# EasyEDA Pro project 3020摄像头 (0323).eprj

# Schematic 原理图
Board Name: esp32; Create Date: 2025-05-14; Page Name: 电源; Project Name: 3020摄像头 (0323); Schematic Name: 原理图; Update Date: 2026-03-18; Company: 嘉立创EDA; Page Size: A3; Version: V1.0
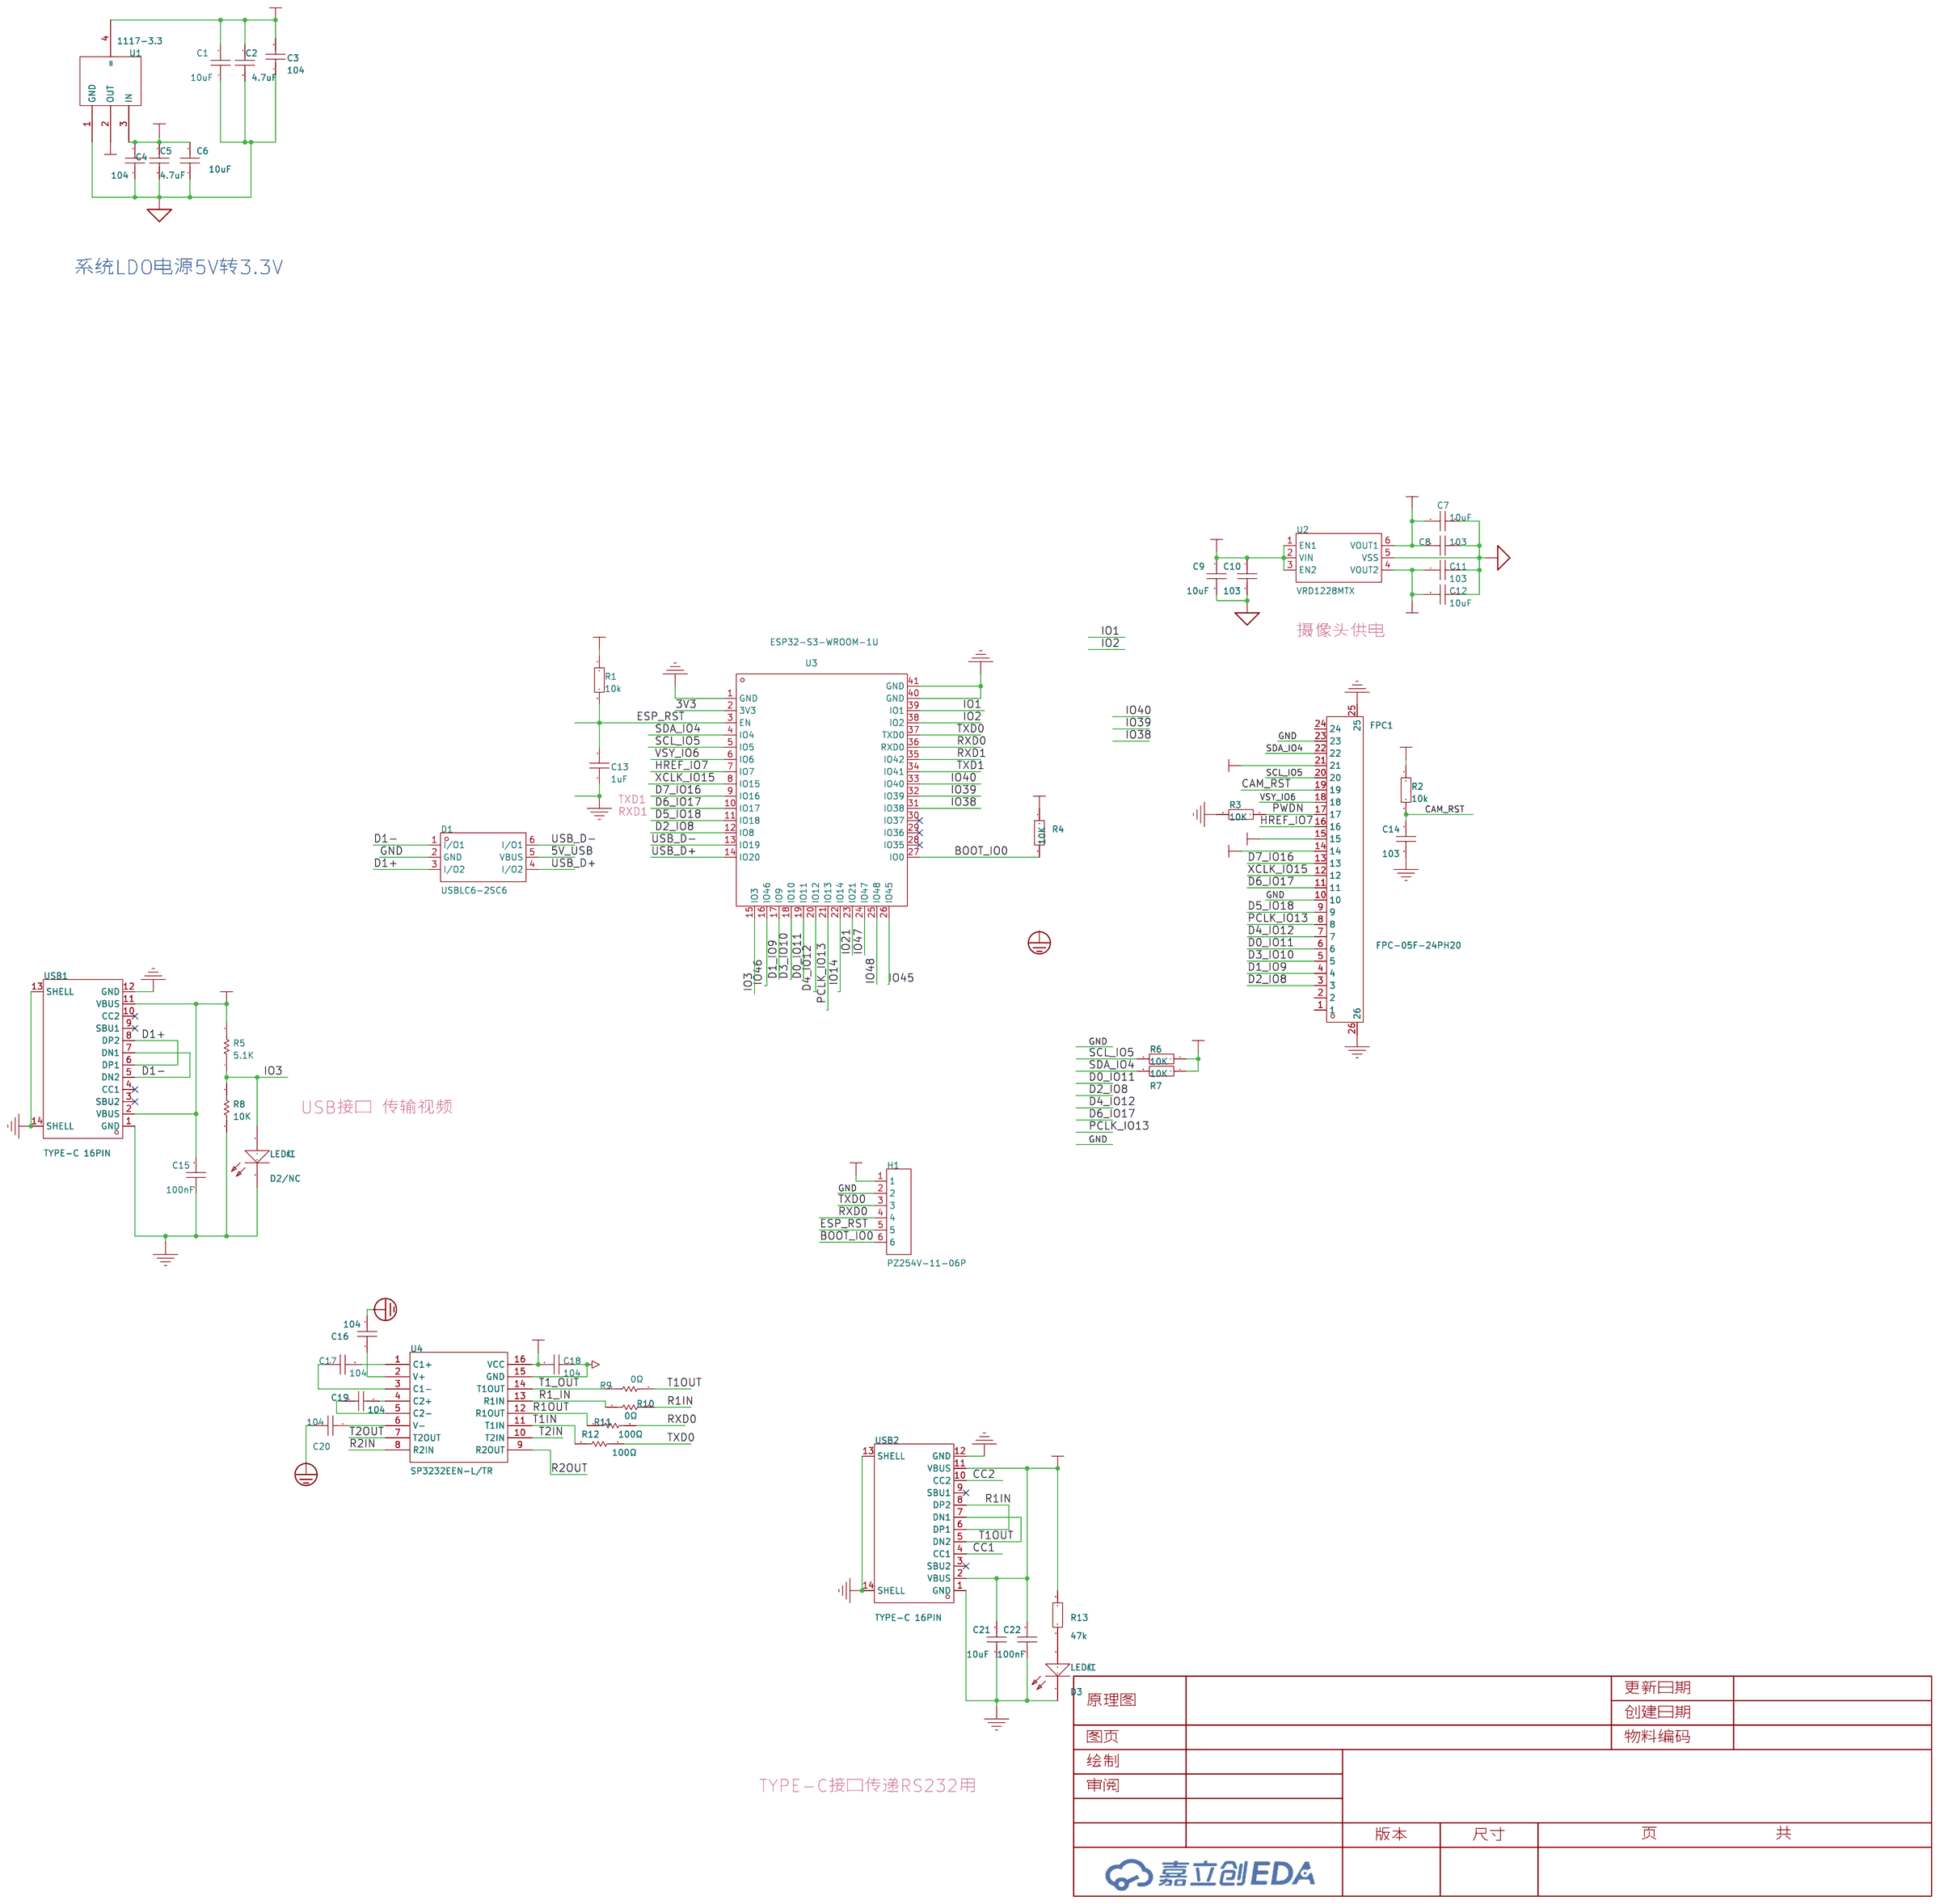
[diagram p0: schematic sheet]

## Parts
C1  10uF  [C1206]
C2  4.7uF  [0805C]
C3  104  [0603C]
C4  104  [0603C]
C5  4.7uF  [0805C]
C6  10uF  [C1206]
C7  10uF  [0805C]
C8  18pF  [0603C]
C9  10uF  [0805C]
C10  18pF  [0603C]
C11  18pF  [0603C]
C12  10uF  [0805C]
C13  1uF  [C0603]
C14  18pF  [0603C]
C15  100nF  [C0603]
C16  104  [0603C]
C17  104  [0603C]
C18  104  [0603C]
C19  104  [0603C]
C20  104  [0603C]
C21  10uF  [C1206]
C22  100nF  [C0603]
D1  USBLC6-2SC6  [SOT-23-6_L2.9-W1.6-P0.95-LS2.8-BL]
D2/NC  LED红  [0603L]
D3  LED红  [0603L]
FPC1  FPC-05F-24PH20  [FPC-SMD_24P-P0.50_FPC-05F-24PH20]
H1  PZ254V-11-06P  [HDR-TH_6P-P2.54-V-M]
R1  10k  [R0603]
R2  10k  [R0603]
R3  10K  [R0603]
R4  10K  [R0603]
R5  10K  [0603R]
R6  10K  [R0603]
R7  10K  [R0603]
R8  10K  [0603R]
R9  0Ω  [0603R]
R10  0Ω  [0603R]
R11  100Ω  [0603R]
R12  100Ω  [0603R]
R13  47k  [R0603]
U1  1117-3.3  [SOT-223]
U2  VRD1228MTX  [SOT-23-6_L2.9-W1.6-P0.95-LS2.8-BL]
U3  ESP32-S3-WROOM-1U  [ESP32-S3-WROOM-1U]
U4  SP3232EEN-L/TR  [SOIC-16_L9.9-W3.9-P1.27-LS6.0-BL]
USB1  TYPE-C 16PIN  [USB-C-SMD_TYPE-C-6PIN+]
USB2  TYPE-C 16PIN  [USB-C-SMD_TYPE-C-6PIN+]

## Library data of the parts
C1 C6 C21 = 104: Design Item ID: CAP; Library Name: SCH--װ--
C2 C5 C7 C9 C12 = 105: Design Item ID: CAP; Library Name: SCH--װ--
C3 C4 = 104: Capacitor (Semiconductor SIM Model); Published: 8-Jun-2000; LatestRevisionDate: 17-Jul-2002; LatestRevisionNote: Re-released for DXP Platform.; PackageReference: C1206; Publisher: Altium Limited; Origin Footprint 2: C1206; Origin Footprint 3: 0402; Origin Footprint 4: 1310[0504]; Origin Footprint 5: 1608[0603]; Origin Footprint 6: C1210; Origin Footprint 7: C0805; Origin Footprint 8: C1206; Origin Footprint 9: 0805; Origin Footprint 10: 0805L; Design Item ID: Cap Semi; Library Name: Miscellaneous Devices
C8 C10 C11 C14 = 33pF: Capacitor (Semiconductor SIM Model); Published: 8-Jun-2000; LatestRevisionDate: 17-Jul-2002; LatestRevisionNote: Re-released for DXP Platform.; PackageReference: C1206; Publisher: Altium Limited; Origin Footprint 2: C1206; Origin Footprint 3: 0402; Origin Footprint 4: 1310[0504]; Origin Footprint 5: 1608[0603]; Origin Footprint 6: C1210; Origin Footprint 7: C0805; Origin Footprint 8: C1206; Origin Footprint 9: 0805; Origin Footprint 10: 0805L; Design Item ID: Cap Semi; Library Name: Miscellaneous Devices
C13 = Cap: Capacitor; Published: 8-Jun-2000; LatestRevisionDate: 17-Jul-2002; LatestRevisionNote: Re-released for DXP Platform.; PackageReference: RAD-0.3; Publisher: Altium Limited; PackageDescription: Radial Cap, Thru-Hole; 2 Leads; 0.3 in Pin Spacing; Origin Footprint 2: C0402; Library Name: Miscellaneous Devices; Check: true
C15 C22 = Cap: Capacitor; Published: 8-Jun-2000; LatestRevisionDate: 17-Jul-2002; LatestRevisionNote: Re-released for DXP Platform.; PackageReference: RAD-0.3; Publisher: Altium Limited; PackageDescription: Radial Cap, Thru-Hole; 2 Leads; 0.3 in Pin Spacing; Origin Footprint 2: LC-0603_C; Origin Footprint 3: LC-0603_C; Library Name: Miscellaneous Devices
C16-C20 = 103: Capacitor (Semiconductor SIM Model); Published: 8-Jun-2000; LatestRevisionDate: 17-Jul-2002; LatestRevisionNote: Re-released for DXP Platform.; PackageReference: C1206; Publisher: Altium Limited; Origin Footprint 2: C1206; Origin Footprint 3: 0402; Origin Footprint 4: 1310[0504]; Origin Footprint 5: 1608[0603]; Origin Footprint 6: C1210; Origin Footprint 7: C0805; Origin Footprint 8: C1206; Origin Footprint 9: 0805; Origin Footprint 10: 0805L; Design Item ID: Cap Semi; Library Name: Miscellaneous Devices
D1 = USBLC6-2SC6: 最大钳位电压:15V;击穿电压:6V;; Supplier Part: C2687116; Manufacturer: UMW(友台半导体); Supplier Footprint: SOT-23-6; JLCPCB Part Class: 扩展库; Datasheet: https://atta.szlcsc.com/upload/public/pdf/source/20231109/512642D850D9873E7C519F71E85B9A10.pdf; Supplier: LCSC; Maximum Clamping Voltage: 15V; Breakdown Voltage: 6V; Number of Lines: 双路; Type: ESD
D2/NC D3 = LED3: Typical BLUE SiC LED; Published: 8-Jun-2000; LatestRevisionDate: 17-Dec-2003; LatestRevisionNote: PCB Footprint replaced.; DatasheetVersion: 16-Apr-2002; PackageVersion: 16-Apr-2002; PackageReference: 3.5X2.8X1.9; Publisher: Altium Limited; PackageDescription: SM LED; 2 C-Bend Leads; Body 3.5 x 2.8 x 1.9 mm, inc leads (LxWxH typ); Origin Footprint 2: 3.5X2.8X1.9; Library Name: Miscellaneous Devices; Check: true
FPC1 = FPC-05F-24PH20: LCSC Part Name: 翻盖式 卧贴 P数:24P 间距:0.5mm; Supplier Part: C2856805; Manufacturer: XUNPU(讯普); Supplier Footprint: SMD,P=0.5mm,卧贴; JLCPCB Part Class: 扩展库; Datasheet: https://item.szlcsc.com/datasheet/FPC-05F-24PH20/3056903.html; Supplier: LCSC; Locking Feature: 翻盖式; Contact Type: 卧贴; Number of Contacts: 24P; Pitch: 0.5mm; Mounting Type: 下接; FFC, FCB Thickness: 0.3mm; Height Above Board: 2mm; Contact Material: 磷青铜; Contact Plating: 锡; Operating Temperature: -25℃~+85℃; Rated Voltage (Max): 50V; Current Rating (Max): 500mA
H1 = PZ254V-11-06P: LCSC Part Name: 1x6P 间距:2.54mm 方针 直插; Supplier Part: C492405; Manufacturer: XFCN(兴飞); Supplier Footprint: 插件,P=2.54mm; JLCPCB Part Class: 扩展库; Datasheet: https://item.szlcsc.com/datasheet/PZ254V-11-06P/502961.html; Supplier: LCSC; Pin Structure: 1x6P; Pitch: 2.54mm; Circluar Pins/Square Pins: 方针; Mounting Type: 直插; Number of Rows: 单排; Number of Pins: 6P; Length of Mating Pin: 6mm; Insulation Height: 2.5mm; Length of End Connection Pin: 3mm; Contact Material: 黄铜; Operating Temperature: -40℃~+105℃; Color: 黑色
R1-R4 R6 R7 R13 = RT0603BRD0710KL: 电阻类型:薄膜电阻;阻值:10kΩ;精度:±0.1%;功率:100mW;温度系数:±25ppm/;最大工作电压:75V;工作温度范围:-55~+155;; LCSC Part Name: 10k-- --0.1%; Supplier Part: C95204; Manufacturer: YAGEO(----); Supplier Footprint: 0603; JLCPCB Part Class: Extended Part; Datasheet: https://atta.szlcsc.com/upload/public/pdf/source/20170217/1487301593756.pdf; Supplier: LCSC; Type: --Ĥ----; Tolerance: --0.1%; Power(Watts): 100mW; Temperature Coefficient: --25ppm/; Overload Voltage (Max): 75V; Operating Temperature Range: -55~+155; Origin Footprint 2: 0402R; Origin Footprint 3: 0402R; Origin Footprint 4: 0603; Check: true
R5 R8 = 10K: Resistor; Published: 8-Jun-2000; LatestRevisionDate: 17-Jul-2002; LatestRevisionNote: Re-released for DXP Platform.; PackageReference: AXIAL-0.3; Publisher: Altium Limited; Origin Footprint 2: AXIAL-0.3; Origin Footprint 3: R0805; Origin Footprint 4: 0805R; Design Item ID: RES; Library Name: SCH封装库
R9-R12 = 100: Resistor; Published: 8-Jun-2000; LatestRevisionDate: 17-Jul-2002; LatestRevisionNote: Re-released for DXP Platform.; PackageReference: AXIAL-0.3; Publisher: Altium Limited; Origin Footprint 2: AXIAL-0.3; Origin Footprint 3: R0805; Origin Footprint 4: 0805R; Design Item ID: RES; Library Name: SCH封装库
U1 = 1117-3.3: Design Item ID: LM1117; Library Name: Party600
U2 = VRD1228MTX: LCSC Part Name: 输入6V 输出1.2V 2.8V 300mA; Supplier Part: C697901; Manufacturer: AnaSem(安纳森); Supplier Footprint: SOT-23-6; JLCPCB Part Class: 扩展库; Datasheet: https://item.szlcsc.com/datasheet/VRD1228MTX/732378.html; Supplier: LCSC; Voltage - Supply: 6V; Output Voltage: 1.2V；2.8V; Power Supply Rejection Ratio (PSRR): 75dB@(1kHz); Voltage Dropout: 90mV; standby current: 25uA; Features: 过流保护；带使能；短路保护; Operating Temperature: -40℃~+85℃; Output Configuration: 正极; Number of Outputs: 2
U3 = ESP32-S3-WROOM-1U: LCSC Part Name: ESP32-S3-WROOM-1-N16R2; Supplier Part: C2913205; Manufacturer: ESPRESSIF(----); Manufacturer Part: ESP32-S3-WROOM-1(N16R2); Supplier Footprint: ģ--; JLCPCB Part Class: Extended Part; Datasheet: https://atta.szlcsc.com/upload/public/pdf/source/20220628/A2AC12B3C87735CAEB7EBE2DBE80936C.pdf; Supplier: LCSC; Design Item ID: ESP32-S3-WROOM-1(N16R2); Check: true
U4 = SP3232EEN-L/TR: LCSC Part Name: True3.0V至5.5V RS-232收发器; Supplier Part: C9378; Manufacturer: MaxLinear(迈凌); Supplier Footprint: SOIC-16; JLCPCB Part Class: 扩展库; Datasheet: https://item.szlcsc.com/datasheet/SP3232EEN-L%252FTR/9907.html; Supplier: LCSC; Type: 收发器; Number of Drivers: 2; Number of Receivers: 2; Data Rate: 235Kbps; Voltage - Supply: 3V~5.5V; Operating Temperature: -40℃~+85℃
USB1 USB2 = TYPE-C 16PIN 2MD(073): 连接器类型:Type-C;标准:-;公母:母;端口数量:1;触点数量:16P;安装方式:卧贴;额定电流 - 电源:5A;工作温度范围:-25℃~+85℃;; LCSC Part Name: Type-C 母 卧贴; Supplier Part: C2765186; Manufacturer: SHOU HAN(首韩); Supplier Footprint: SMD; JLCPCB Part Class: Extended Part; Datasheet: https://atta.szlcsc.com/upload/public/pdf/source/20211123/39B17C16241EAC15C5E277BDA434118E.pdf; Supplier: LCSC; Connector Type: Type-C; Gender: 母; Number of Ports: 1; Number of Contacts: 16P; Mounting Style: 卧贴; Current Rating - Power (Max): 5A; Operating Temperature Range: -25℃~+85℃

## Nets
1.2V: C7.1 C8.1 FPC1.15 U2.6(VOUT1)
2.8V: C11.1 C12.1 FPC1.14 FPC1.21 U2.4(VOUT2)
3V3: C1.2 C2.1 C3.2 R1.1 R2.1 R4.1 R6.1 R7.1 U1.2(OUT) U1.4(=) U3.2(3V3)
5V_USB: C15.2 D1.5(VBUS) R5.2 USB1.2(VBUS) USB1.11(VBUS)
5V_VCC: C4.2 C5.1 C6.2 C9.1 C10.1 C18.2 C21.2 C22.2 H1.1 R13.2 U1.3(IN) U2.1(EN1) U2.2(VIN) U2.3(EN2) U4.16(VCC) USB2.2(VBUS) USB2.11(VBUS)
GND: C1.1 C2.2 C3.1 C4.1 C5.2 C6.1 C7.2 C8.2 C9.2 C10.2 C11.2 C12.2 C13.1 C14.2 C15.1 C16.1 C18.1 C20.2 C21.1 C22.1 D1.2(GND) D2/NC.2(K) D3.2(K) FPC1.10 FPC1.23 FPC1.25 FPC1.26 H1.2 R3.2 R8.1 U1.1(GND) U2.5(VSS) U3.1(GND) U3.40(GND) U3.41(GND) U4.15(GND) USB1.1(GND) USB1.12(GND) USB1.13(SHELL) USB1.14(SHELL) USB2.1(GND) USB2.12(GND) USB2.13(SHELL) USB2.14(SHELL)
BOOT_IO0: H1.6 R4.2 U3.27(IO0)
CAM_RST: C14.1 FPC1.19 R2.2
CC1: USB2.4(CC1)
CC2: USB2.10(CC2)
D0_IO11: FPC1.6 U3.19(IO11)
D1+: D1.3(I/O2) USB1.6(DP1) USB1.8(DP2)
D1-: D1.1(I/O1) USB1.5(DN2) USB1.7(DN1)
D1_IO9: FPC1.4 U3.17(IO9)
D2_IO8: FPC1.3 U3.12(IO8)
D3_IO10: FPC1.5 U3.18(IO10)
D4_IO12: FPC1.7 U3.20(IO12)
D5_IO18: FPC1.9 U3.11(IO18)
D6_IO17: FPC1.11 U3.10(IO17)
D7_IO16: FPC1.13 U3.9(IO16)
ESP_RST: C13.2 H1.5 R1.2 U3.3(EN)
HREF_IO7: FPC1.16 U3.7(IO7)
IO1: U3.39(IO1)
IO2: U3.38(IO2)
IO3: D2/NC.1(A) R5.1 R8.2 U3.15(IO3)
IO14: U3.22(IO14)
IO21: U3.23(IO21)
IO38: U3.31(IO38)
IO39: U3.32(IO39)
IO40: U3.33(IO40)
IO45: U3.26(IO45)
IO46: U3.16(IO46)
IO47: U3.24(IO47)
IO48: U3.25(IO48)
PCLK_IO13: FPC1.8 U3.21(IO13)
PWDN: FPC1.17 R3.1
R1_IN: R10.1 U4.13(R1IN)
R1IN: R10.2 USB2.6(DP1) USB2.8(DP2)
R1OUT: R11.1 U4.12(R1OUT)
R2IN: U4.8(R2IN)
R2OUT: U4.9(R2OUT)
RXD0: H1.4 R11.2 U3.36(RXD0)
RXD1: U3.35(IO42)
SCL_IO5: FPC1.20 R6.2 U3.5(IO5)
SDA_IO4: FPC1.22 R7.2 U3.4(IO4)
T1_OUT: R9.1 U4.14(T1OUT)
T1IN: R12.1 U4.11(T1IN)
T1OUT: R9.2 USB2.5(DN2) USB2.7(DN1)
T2IN: U4.10(T2IN)
T2OUT: U4.7(T2OUT)
TXD0: H1.3 R12.2 U3.37(TXD0)
TXD1: U3.34(IO41)
USB_D+: D1.4(I/O2) U3.14(IO20)
USB_D-: D1.6(I/O1) U3.13(IO19)
VSY_IO6: FPC1.18 U3.6(IO6)
XCLK_IO15: FPC1.12 U3.8(IO15)
$9N284520: C20.1 U4.6(V-)
$9N284523: C16.2 U4.2(V+)
$9N284524: C19.2 U4.4(C2+)
$9N284525: C19.1 U4.5(C2-)
$9N284526: C17.2 U4.1(C1+)
$9N284527: C17.1 U4.3(C1-)
$9N284875: D3.1(A) R13.1

Not connected (* = marked no-connect by the designer): FPC1 1 2 24; U3 28(IO35)* 29(IO36)* 30(IO37)*; USB1 3(SBU2)* 4(CC1)* 9(SBU1)* 10(CC2)*; USB2 3(SBU2)* 9(SBU1)*

## Notes on the sheet
- 系统LDO电源5V转3.3V
- 摄像头供电
- RXD1
- TXD1
- USB接口 传输视频
- TYPE-C接口传递RS232用

# Board PCB
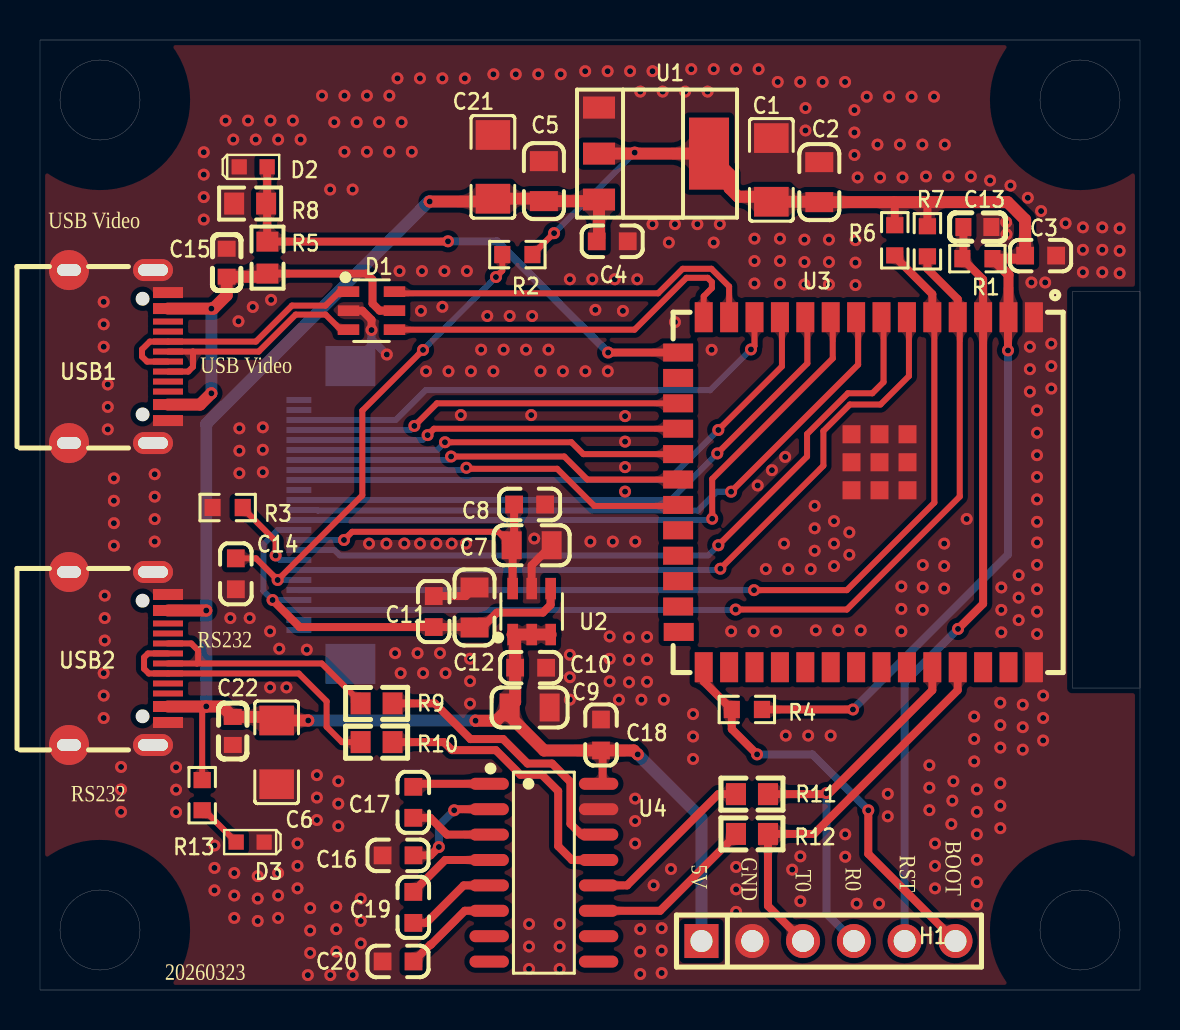
[diagram p1: board, top side]
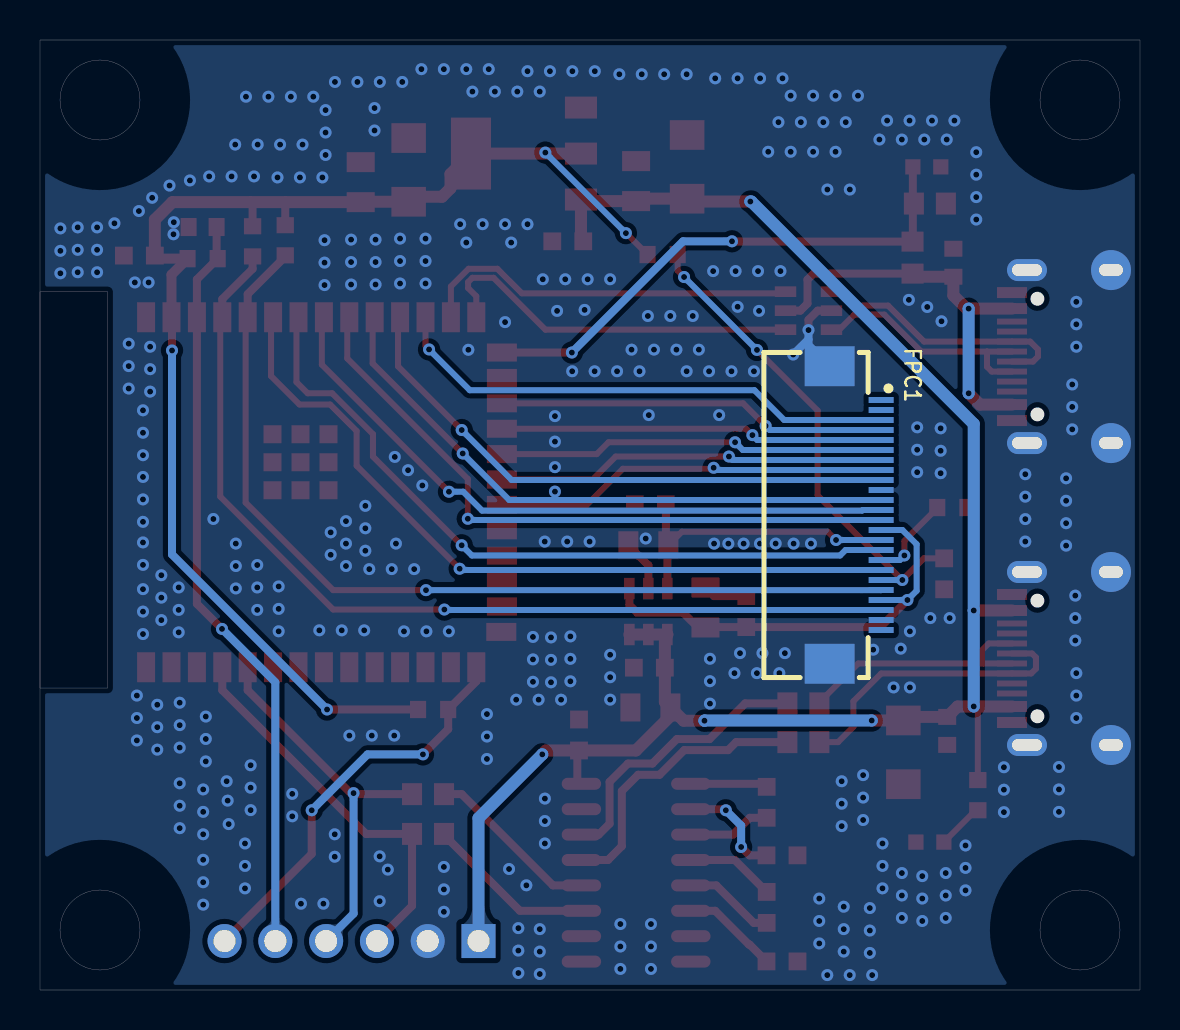
[diagram p2: board, bottom side, seen from below]

Outline 55 x 47.5 mm; copper layers: Top Layer, Bottom Layer. Coordinates in mm from the lower left corner of the outline.
Outline path: rectangle 0,47.5 55,0 ; circle c3,44.5 r2 ; circle c3,3 r2 ; rectangle 51.61,34.91 55,15.1 ; circle c52,44.5 r2 ; circle c52,3 r2
Stack: Top Layer 0.035mm / Dielectric1 1.51mm FR4 er 4.5 / Bottom Layer 0.035mm

## Design rules (mm)
net D1+: DP2
net USB_D+: DP1
net USB_D-: DP1
template: 用户自定义配置
spacing Default (default): track to track 0.152, other pairs 0 to 0.152
track width Default (default): min 0.254, default 0.254, max 25.4
differential pair differentialPair (default): width min 0.127, default 0.254, max 2.54; gap min 0.152, default 0.152
via Default (default): diameter min 0.25, default 0.61, max 100.025; hole min 0.2, default 0.305, max 59.995

## Placement (name value [footprint] x y rotation side)
C1  10uF  [C1206]  36.57 41 270 top
C2  4.7uF  [0805C]  38.96 40.39 90 top
C3  104  [0603C]  50.03 36.72 180 top
C4  104  [0603C]  28.61 37.43 180 top
C5  4.7uF  [0805C]  25.19 40.44 90 top
C6  10uF  [C1206]  11.83 11.88 90 top
C7  10uF  [0805C]  24.58 22.24 0 top
C8  18pF  [0603C]  24.48 24.28 0 top
C9  10uF  [0805C]  24.48 14.13 0 top
C10  18pF  [0603C]  24.53 16.12 0 top
C11  18pF  [0603C]  19.69 18.92 90 top
C12  10uF  [0805C]  21.73 19.13 90 top
C13  1uF  [C0603]  46.87 38.15 180 top
C14  18pF  [0603C]  9.79 20.81 270 top
C15  100nF  [C0603]  9.33 36.36 270 top
C16  104  [0603C]  17.9 6.73 0 top
C17  104  [0603C]  18.67 9.38 90 top
C18  104  [0603C]  28.05 12.75 270 top
C19  104  [0603C]  18.67 4.13 90 top
C20  104  [0603C]  17.9 1.43 180 top
C21  10uF  [C1206]  22.64 41.16 270 top
C22  100nF  [C0603]  9.64 12.95 90 top
D1  USBLC6-2SC6  [SOT-23-6_L2.9-W1.6-P0.95-LS2.8-BL]  16.58 33.97 270 top
D2  LED红  [0603L]  10.66 41.16 180 top
D3  LED红  [0603L]  10.51 7.4 0 top
FPC1  FPC-05F-24PH20  [FPC-SMD_24P-P0.50_FPC-05F-24PH20]  14.23 23.75 270 bottom
H1  PZ254V-11-06P  [HDR-TH_6P-P2.54-V-M]  39.42 2.45 0 top
R1  10k  [R0603]  46.87 36.57 180 top
R2  10k  [R0603]  23.87 36.77 180 top
R3  10K  [R0603]  9.38 24.12 180 top
R4  10K  [R0603]  35.34 14.03 180 top
R5  10K  [0603R]  11.37 36.62 270 top
R6  10K  [R0603]  42.74 37.49 270 top
R7  10K  [R0603]  44.37 37.43 270 top
R8  10K  [0603R]  10.51 39.32 0 top
R9  0Ω  [0603R]  16.83 14.33 180 top
R10  0Ω  [0603R]  16.83 12.39 180 top
R11  100Ω  [0603R]  35.6 9.79 0 top
R12  100Ω  [0603R]  35.6 7.8 0 top
R13  47k  [R0603]  8.11 9.74 90 top
U1  1117-3.3  [SOT-223]  30.65 41.82 270 top
U2  VRD1228MTX  [SOT-23-6_L2.9-W1.6-P0.95-LS2.8-BL]  24.58 18.92 0 top
U3  -  [ESP32-S3-WROOM-1U]  40.8 24.89 270 top
U4  SP3232EEN-L/TR  [SOIC-16_L9.9-W3.9-P1.27-LS6.0-BL]  25.19 5.87 270 top
USB1  TYPE-C 16PIN  [USB-C-SMD_TYPE-C-6PIN+]  3.83 31.67 270 top
USB2  TYPE-C 16PIN  [USB-C-SMD_TYPE-C-6PIN+]  3.83 16.58 270 top

## Footprints (pads in the part's own frame, mm; a bottom-side part is the same pattern mirrored in y, then rotated)
0603C
  rect 0.889x0.889 smd: 1(-0.774,0) 2(0.774,0)
0603L
  rect 0.762x0.762 smd: 1(-0.699,0) 2(0.699,0)
0603R
  rect 1x1.1 smd: 1(-0.8,0) 2(0.8,0)
0805C
  rect 1x1.4 smd: 1(-1,0) 2(1,0)
C0603
  rect 0.8x0.9 smd: 1(-0.7,0) 2(0.7,0)
C1206
  rect 1.485x1.728 smd: 1(-1.593,0) 2(1.593,0)
ESP32-S3-WROOM-1U
  rect 1.5x0.9 smd: 1(-8.75,8.895) 2(-8.75,7.625) 3(-8.75,6.355) 4(-8.75,5.085) 5(-8.75,3.815) 6(-8.75,2.545) 7(-8.75,1.275) 8(-8.75,0.005) 9(-8.75,-1.265) 10(-8.75,-2.535) 11(-8.75,-3.805) 12(-8.75,-5.075) 13(-8.75,-6.345) 14(-8.75,-7.615) 27(8.75,-7.615) 28(8.75,-6.345) 29(8.75,-5.075) 30(8.75,-3.805) 31(8.75,-2.535) 32(8.75,-1.265) 33(8.75,0.005) 34(8.75,1.275) 35(8.75,2.545) 36(8.75,3.815) 37(8.75,5.085) 38(8.75,6.355) 39(8.75,7.625) 40(8.75,8.895)
  rect 0.9x1.5 smd: 15(-6.985,-8.895) 16(-5.715,-8.895) 17(-4.445,-8.895) 18(-3.175,-8.895) 19(-1.905,-8.895) 20(-0.635,-8.895) 21(0.635,-8.895) 22(1.905,-8.895) 23(3.175,-8.895) 24(4.445,-8.895) 25(5.715,-8.895) 26(6.985,-8.865)
  rect 0.9x0.9 smd: 41(-2.9,2.575) 41(-2.9,1.175) 41(-2.9,-0.225) 41(-1.5,2.575) 41(-1.5,1.175) 41(-1.5,-0.225) 41(-0.1,2.575) 41(-0.1,1.175) 41(-0.1,-0.225)
FPC-SMD_24P-P0.50_FPC-05F-24PH20
  rect 0.3x1.25 smd: 1(-5.75,1.288) 2(-5.25,1.288) 3(-4.75,1.288) 4(-4.25,1.288) 5(-3.75,1.288) 6(-3.25,1.288) 7(-2.75,1.288) 8(-2.25,1.288) 9(-1.75,1.288) 10(-1.25,1.288) 11(-0.75,1.288) 12(-0.25,1.288) 13(0.25,1.288) 14(0.75,1.288) 15(1.25,1.288) 16(1.75,1.288) 17(2.25,1.288) 18(2.75,1.288) 19(3.25,1.288) 20(3.75,1.288) 21(4.25,1.288) 22(4.75,1.288) 23(5.25,1.288) 24(5.75,1.288)
  rect 2x2.5 smd: 25(7.44,-1.288) 26(-7.44,-1.288)
HDR-TH_6P-P2.54-V-M
  rect 1.7x1.7 hole 1.1: 1(-6.35,0)
  round 1.7 hole 1.1: 2(-3.81,0) 3(-1.27,0) 4(1.27,0) 5(3.81,0) 6(6.35,0)
R0603
  rect 0.806x0.864 smd: 1(-0.753,0) 2(0.753,0)
SOIC-16_L9.9-W3.9-P1.27-LS6.0-BL
  oval 0.602x1.971 smd: 1(-4.445,-2.736) 2(-3.175,-2.736) 3(-1.905,-2.736) 4(-0.635,-2.736) 5(0.635,-2.736) 6(1.905,-2.736) 7(3.175,-2.736) 8(4.445,-2.736) 9(4.445,2.736) 10(3.175,2.736) 11(1.905,2.736) 12(0.635,2.736) 13(-0.635,2.736) 14(-1.905,2.736) 15(-3.175,2.736) 16(-4.445,2.736)
SOT-23-6_L2.9-W1.6-P0.95-LS2.8-BL
  rect 0.532x1.072 smd: 1(-0.95,-1.149) 2(0,-1.149) 3(0.95,-1.149) 4(0.95,1.149) 5(0,1.149) 6(-0.95,1.149)
SOT-223
  rect 1.1x1.6 smd: 1(-2.3,-2.7) 2(0,-2.7) 3(2.3,-2.7)
  rect 3.6x2 smd: 4(0,2.8)
USB-C-SMD_TYPE-C-6PIN+
  rect 0.55x1.5 smd: 1(-3.2,2.575) 2(-2.4,2.575) 11(2.4,2.575) 12(3.2,2.575)
  rect 0.3x1.5 smd: 3(-1.75,2.575) 4(-1.25,2.575) 5(-0.75,2.575) 6(-0.25,2.575) 7(0.25,2.575) 8(0.75,2.575) 9(1.25,2.575) 10(1.75,2.575)
  oval 1.1x2 hole 0.6x1.5: 13(-4.325,1.825) 14(4.325,1.825)
  oval 2x2 hole 0.6x1.2: 13(-4.325,-2.375) 14(4.325,-2.375)

## Nets
As in the schematic, except:
GND: C1.1 C2.2 C3.1 C4.1 C5.2 C6.1 C7.2 C8.2 C9.2 C10.2 C11.2 C12.2 C13.1 C14.2 C15.1 C16.1 C18.1 C20.2 C21.1 C22.1 D1.2 D2.2 D3.2 FPC1.10 FPC1.23 FPC1.25 FPC1.26 H1.2 R3.2 R8.1 U1.1 U2.5 U3.1 U3.40 U3.41 U4.15 USB1.1 USB1.12 USB1.13 USB1.14 USB2.1 USB2.12 USB2.13 USB2.14
IO3: D2.1 R5.1 R8.2 U3.15

Pads without a net: FPC1 1 2 24; U3 28 29 30; USB1 3 4 9 10; USB2 3 9

## Via types
v1: diameter 0.6, hole 0.3, Top Layer to Bottom Layer, 414 vias

## Routing (per net, layer and track width the routed paths; a pad name or vN(x,y) marks a point on that pad's centre or on a via; arc(x,y) is an arc through that point)
1.2V: length 15.4
  Top Layer w0.3: v1(15.2,22.5) 15.61,22.91 22.91,22.91 C7.1
  Top Layer w0.4: C8.1 23.71,22.36 C7.1 23.63,22.19 U2.6
  Bottom Layer w0.3: 12.94,22.5 v1(15.2,22.5)
2.8V: length 22.1
  Top Layer w0.4: U2.4 25.53,19.26 25.14,18.87 22.85,18.87 22.1,18.13 C12.1 21.7,18.15 C11.1 12.98,18.15 v1(11.63,19.5)
  Bottom Layer w0.3: 12.94,19.5 v1(11.63,19.5) 11.17,19.96 11.17,22.29 11.88,23 12.94,23
3V3: length 66.9
  Top Layer w0.3: R2.1 25.69,37.84 v1(25.7,37.84)
  Top Layer w0.4: R4.1 v1(40.65,14.03) ; R6.1 42.74,39.38 42.72,39.39 ; v1(48.4,31.98) 48.4,33.61 U3.2 ; R7.1 44.37,39.3 44.47,39.39
  Top Layer w0.5: U3.2 48.43,35.77 R1.1 49.1,36.57 C3.2
  Top Layer w0.6: U1.2 U1.4 34.48,40.8 34.48,40.09 34.9,39.66 36.32,39.66 C1.2 38.95,39.41 C2.1 48.38,39.39 49.26,38.52 C3.2
  Bottom Layer w0.3: v1(25.7,37.84) v1(29.73,41.87)
  Bottom Layer w0.4: v1(40.65,14.03) 48.4,21.78 v1(48.4,31.98)
5V_USB: length 20.7
  Top Layer w0.4: R5.2 16.33,35.82 16.63,35.52 16.63,34.32 16.98,33.97 D1.5
  Top Layer w0.6: USB1.2 8.67,34.07 9.33,34.73 C15.2 11.22,35.66 R5.2 ; v1(8.57,29.84) 8,29.27 USB1.11
  Bottom Layer w0.6: v1(8.57,29.84) v1(8.57,34.07)
5V_VCC: length 89.7
  Top Layer w0.3: R13.2 8.11,13.97 8.31,14.17 v1(8.31,14.18)
  Top Layer w0.4: 28.05,11.98 28.13,11.89 28.13,10.31
  Top Layer w0.6: USB2.11 9.12,14.17 C22.2 11.65,13.65 C6.2 v1(13.41,13.48) ; U2.3 U2.2 U2.1 23.76,17.65 C10.1 23.76,14.4 C9.1 ; v1(21.78,13.46) 22.82,13.46 C9.1 ; v1(29.89,11.78) 29.69,11.98 25.2,11.98 23.48,13.7 C9.1 ; USB2.2 v1(8.31,18.98) ; v1(19.48,39.42) 22.5,39.42 C21.2 25.07,39.56 C5.1 27.87,39.44 U1.3 27.95,37.55 C4.2
  Bottom Layer w0.6: v1(21.78,13.46) 21.77,13.48 v1(13.41,13.48) ; v1(8.31,14.18) v1(8.31,18.98) 8.31,28.31 19.43,39.42 v1(19.48,39.42) ; v1(29.89,11.78) 33.07,8.59 H1.1
GND: length 10
  Top Layer w0.4: 15.43,33.97 16.12,33.97 16.58,33.51 v1(16.58,33) ; C11.2 21.3,19.7 C12.2 ; U2.5 24.58,21.24 C7.2
  Bottom Layer w0.4: v1(16.58,33) 16.58,32.54 ; 16.58,32.54 16.58,32.25 FPC1.26 ; 16.58,32.54 v1(17.34,31.77)
  vias: v1(3.19,34.41) v1(3.19,33.29) v1(3.19,32.16) v1(3.24,19.72) v1(3.24,18.6) v1(3.24,17.48) v1(3.19,15.84) v1(3.19,14.72) v1(3.19,13.6) v1(3.39,30.28) v1(3.39,29.15) v1(3.39,28.03) v1(3.7,25.58) v1(3.7,24.46) v1(3.7,23.34) v1(3.7,22.22) v1(4.05,11.15) v1(4.05,10.03) v1(4.05,8.91) v1(5.73,25.79) v1(5.73,24.67) v1(5.73,23.54) v1(5.73,22.42) v1(6.8,11.14) v1(6.8,10.02) v1(6.8,8.89) v1(8.19,41.89) v1(8.19,40.77) v1(8.19,39.65) v1(8.19,38.52) v1(8.72,7.23) v1(8.72,6.1) v1(8.72,4.98) v1(9.28,43.47) v1(9.52,18.6) v1(9.66,42.52) v1(9.71,5.85) v1(9.71,4.73) v1(9.71,3.6) v1(9.92,33.44) v1(9.97,28.08) v1(9.97,26.96) v1(9.97,25.84) v1(10.4,43.47) v1(10.48,18.6) v1(10.64,34.15) v1(10.79,42.52) v1(10.89,5.69) v1(10.89,4.57) v1(10.89,3.45) v1(11.14,28.13) v1(11.14,27.01) v1(11.14,25.89) v1(11.52,43.47) v1(11.56,34.51) v1(11.51,17.93) v1(11.51,15.13) v1(11.91,42.52) v1(11.91,5.85) v1(11.91,4.73) v1(11.91,3.6) v1(11.96,17.07) v1(12.32,15.13) v1(12.64,43.47) v1(12.88,7.33) v1(12.88,6.2) v1(12.88,5.08) v1(13.03,42.52) v1(13.34,17.02) v1(13.39,0.75) v1(13.51,4.1) v1(13.51,2.97) v1(13.51,1.85) v1(13.84,10.74) v1(13.84,9.62) v1(13.84,8.5) v1(14.1,44.72) v1(14.51,40.02) v1(14.51,0.75) v1(14.71,43.39) v1(14.81,4.16) v1(14.81,3.04) v1(14.81,1.92) v1(14.92,10.44) v1(14.92,9.32) v1(14.92,8.19) v1(15.22,44.72) v1(15.22,41.91) v1(15.63,40.02) v1(15.64,0.75) v1(15.83,43.39) v1(16.04,4.57) v1(16.04,3.45) v1(16.04,2.33) v1(16.35,44.72) v1(16.35,41.91) v1(16.45,22.32) v1(16.96,43.39) v1(17.32,22.32) v1(17.47,44.72) v1(17.47,41.91) v1(17.76,16.84) v1(17.88,45.58) v1(17.98,35.94) v1(18.03,15.84) v1(18.08,43.39) v1(18.22,22.32) v1(18.59,41.91) v1(18.88,16.84) v1(19,45.58) v1(19.05,33.96) v1(19,22.32) v1(19.1,35.94) v1(19.16,15.84) v1(19.3,30.94) v1(19.82,22.32) v1(20,16.84) v1(20.12,45.58) v1(20.12,34.16) v1(20.22,35.94) v1(20.28,15.84) v1(20.42,30.94) v1(20.58,22.32) v1(21.04,28.74) v1(21.24,45.58) v1(21.34,35.94) v1(21.3,22.32) v1(21.55,30.94) v1(21.5,16.56) v1(21.5,15.44) v1(21.5,14.32) v1(22.06,32.02) v1(22.36,33.7) v1(22.67,45.79) v1(22.67,30.94) v1(23.18,32.02) v1(23.48,33.7) v1(23.79,45.79) v1(24.3,32.02) v1(24.45,3.3) v1(24.45,2.18) v1(24.45,1.05) v1(24.61,33.7) v1(24.56,28.74) v1(24.71,22.57) v1(24.91,45.79) v1(25.03,30.94) v1(25.42,32.02) v1(26.04,45.79) v1(25.98,3.3) v1(25.98,2.18) v1(25.98,1.05) v1(26.15,30.94) v1(26.49,35.54) v1(26.49,16.76) v1(26.49,15.64) v1(26.49,14.52) v1(27.26,45.94) v1(27.27,30.94) v1(27.52,22.42) v1(27.62,35.54) v1(27.77,34.01) v1(28.38,45.94) v1(28.39,30.94) v1(28.48,17.68) v1(28.48,16.56) v1(28.48,15.44) v1(28.64,22.42) v1(28.74,35.54) v1(28.95,14.52) v1(29.15,33.96) v1(29.25,28.69) v1(29.25,27.42) v1(29.25,26.14) v1(29.45,17.63) v1(29.45,16.51) v1(29.45,15.38) v1(29.5,45.94) v1(29.76,9.57) v1(29.76,8.45) v1(29.76,7.33) v1(29.76,22.42) v1(29.86,35.54) v1(30.01,44.92) v1(30.01,3.04) v1(30.01,1.92) v1(30.01,0.8) v1(30.07,14.52) v1(30.35,17.65) v1(30.35,16.53) v1(30.35,15.41) v1(30.63,45.94) v1(30.63,38.29) v1(30.68,5.23) v1(31.14,44.92) v1(31.08,3.09) v1(31.08,1.97) v1(31.08,0.85) v1(31.19,14.52) v1(31.44,37.37) v1(31.55,6.05) v1(31.75,38.29) v1(31.75,33.39) v1(32.26,44.92) v1(32.56,46.04) v1(32.65,13.8) v1(32.65,12.67) v1(32.65,11.55) v1(32.87,38.29) v1(33.38,44.92) v1(33.58,32.01) v1(33.69,46.04) v1(33.69,37.37) v1(33.99,38.29) v1(34.56,17.93) v1(34.81,46.04) v1(34.81,6.15) v1(34.81,5.03) v1(34.81,3.91) v1(35.72,37.57) v1(35.72,36.45) v1(35.72,35.33) v1(35.68,17.93) v1(35.93,46.04) v1(35.88,25.23) v1(36.29,21.04) v1(36.6,25.99) v1(36.8,17.93) v1(36.89,45.4) v1(37,37.57) v1(37,36.45) v1(37,35.33) v1(37.2,22.32) v1(37.26,26.65) v1(37.29,12.72) v1(37.41,21.04) v1(37.61,6.02) v1(38.01,45.4) v1(38.02,6.68) v1(38.02,4.44) v1(38.22,37.52) v1(38.22,36.4) v1(38.22,35.27) v1(38.27,44.1) v1(38.27,42.98) v1(38.41,12.72) v1(38.54,21.04) v1(38.73,24.21) v1(38.73,23.09) v1(38.73,21.96) v1(38.79,17.98) v1(39.13,45.4) v1(39.45,37.52) v1(39.45,36.4) v1(39.45,35.27) v1(39.53,12.72) v1(39.7,23.44) v1(39.7,22.32) v1(39.7,21.2) v1(39.91,17.98) v1(40.25,45.4) v1(40.26,7.79) v1(40.26,6.66) v1(40.47,22.88) v1(40.47,21.76) v1(40.72,44) v1(40.72,42.87) v1(40.72,41.75) v1(40.77,37.49) v1(40.77,36.37) v1(40.77,35.25) v1(40.83,4.32) v1(40.88,40.63) v1(41.03,17.98) v1(41.34,44.67) v1(41.87,42.27) v1(41.95,4.32) v1(42,40.63) v1(42.46,44.67) v1(42.39,9.81) v1(42.39,8.68) v1(43,42.27) v1(43.13,40.63) v1(43.07,20.18) v1(43.07,19.06) v1(43.07,17.93) v1(43.58,44.67) v1(44.12,42.27) v1(44.14,21.25) v1(44.14,20.13) v1(44.14,19.01) v1(44.3,40.68) v1(44.47,11.24) v1(44.47,10.11) v1(44.47,8.99) v1(44.7,44.67) v1(44.75,7.33) v1(44.75,6.2) v1(44.75,5.08) v1(45.24,42.27) v1(45.21,22.32) v1(45.21,21.2) v1(45.21,20.08) v1(45.42,40.68) v1(45.62,9.47) v1(45.57,8.3) v1(45.67,10.44) v1(46.33,23.55) v1(46.54,40.68) v1(46.71,13.67) v1(46.71,12.55) v1(46.71,11.43) v1(46.84,10.03) v1(46.84,8.91) v1(46.84,7.79) v1(46.84,6.51) v1(46.84,5.39) v1(46.84,4.27) v1(47.5,40.48) v1(48.02,14.36) v1(48.02,13.24) v1(48.02,12.12) v1(48.02,10.34) v1(48.02,9.21) v1(48.02,8.09) v1(48.07,20.13) v1(48.07,19.01) v1(48.07,17.88) v1(48.31,38.39) v1(48.33,37.79) v1(48.53,40.22) v1(48.93,20.74) v1(48.93,19.62) v1(48.93,18.5) v1(49.14,14.26) v1(49.14,13.14) v1(49.14,12.02) v1(49.39,39.61) v1(49.49,32.16) v1(49.49,31.04) v1(49.49,29.92) v1(49.57,35.38) v1(49.85,28.98) v1(49.85,27.86) v1(49.85,26.74) v1(49.85,25.65) v1(49.85,24.53) v1(49.85,23.41) v1(49.85,22.38) v1(49.85,21.26) v1(49.85,20.04) v1(49.85,18.92) v1(49.85,17.8) v1(50.05,38.95) v1(50.16,14.72) v1(50.16,13.6) v1(50.16,12.48) v1(50.26,35.38) v1(50.57,32.32) v1(50.57,31.19) v1(50.57,30.07) v1(51.28,38.33) v1(52.15,38.13) v1(52.15,37.01) v1(52.15,35.89) v1(53.11,38.13) v1(53.11,37.01) v1(53.11,35.89) v1(53.98,38.08) v1(53.98,36.96) v1(53.98,35.84)
BOOT_IO0: length 20.5
  Top Layer w0.4: v1(41.41,8.99) 41.41,6.81 H1.6 ; v1(35.85,11.78) 34.59,13.04 R4.2 33.19,15.43 U3.27
  Bottom Layer w0.4: v1(41.41,8.99) 38.62,11.78 v1(35.85,11.78)
CAM_RST: length 24.5
  Top Layer w0.3: v1(22.8,35.65) 23.11,35.97 R2.2 ; v1(19.15,32) 16.12,28.97 16.12,24.73 v1(11.88,20.5) 10.8,21.58 C14.1
  Bottom Layer w0.3: 12.94,20.5 v1(11.88,20.5) ; v1(19.15,32) v1(22.8,35.65)
D0_IO11: length 19.4
  Top Layer w0.3: v1(20.25,27.39) 26.57,27.39 27.17,26.79 U3.19
  Bottom Layer w0.3: 12.94,27 19.86,27 v1(20.25,27.39)
D1+: length 12.2
  Top Layer w0.3: 15.43,33.02 15.03,33.02 14.28,33.77 12.78,33.77 10.94,31.92 7.64,31.92 ; 7.64,31.92 7.65,31.91 7.65,31.16 7.41,30.92 USB1.8 ; 7.64,31.92 USB1.6
D1-: length 13.3
  Top Layer w0.3: USB1.7 5.35,31.42 5.1,31.67 5.1,32.03 5.49,32.42 USB1.5 10.8,32.42 12.6,34.22 14.28,34.22 14.98,34.92 15.43,34.92
D1_IO9: length 19.5
  Top Layer w0.3: 31.91,29.33 19.85,29.33 v1(18.72,28.2)
  Bottom Layer w0.3: v1(18.72,28.2) 18.51,28 12.94,28
D2_IO8: length 25.8
  Top Layer w0.3: U3.12 35.73,32.21 v1(35.55,32.03)
  Bottom Layer w0.3: v1(35.55,32.03) 33.51,29.99 19.28,29.99 17.79,28.5 12.94,28.5
D3_IO10: length 19.2
  Top Layer w0.3: v1(19.38,27.74) 19.7,28.06 U3.18
  Bottom Layer w0.3: 12.94,27.5 19.14,27.5 v1(19.38,27.74)
D4_IO12: length 19.5
  Top Layer w0.3: U3.20 27.36,25.52 26.21,26.67 v1(20.55,26.67)
  Bottom Layer w0.3: v1(20.55,26.67) 20.38,26.5 12.94,26.5
D5_IO18: length 28.9
  Top Layer w0.3: 37.1,33.59 37.1,31.18 v1(33.92,28)
  Bottom Layer w0.3: v1(33.92,28) 31.42,25.5 12.94,25.5
D6_IO17: length 30.5
  Top Layer w0.3: v1(33.86,26.83) 38.37,31.33 38.37,33.59
  Bottom Layer w0.3: v1(33.86,26.83) 31.54,24.5 12.94,24.5
  vias: v1(29.25,24.92)
D7_IO16: length 33.2
  Top Layer w0.3: v1(33.61,23.56) 33.61,25.55 39.64,31.58 39.64,33.59
  Bottom Layer w0.3: 12.94,23.5 33.55,23.5 v1(33.61,23.56)
ESP_RST: length 37.8
  Top Layer w0.4: C13.2 46.17,36.62 R1.2 47.16,35.53 U3.3 47.16,19.31 v1(45.9,18.05)
  Bottom Layer w0.4: H1.5 43.23,15.39 v1(45.9,18.05)
HREF_IO7: length 36.8
  Top Layer w0.3: 42.18,33.59 42.18,30.4 41.62,29.84 40.39,29.84 38.35,27.8 38.35,26.67 v1(33.92,22.24)
  Bottom Layer w0.3: 12.94,22 14.72,22 14.99,21.73 33.41,21.73 v1(33.92,22.24)
IO3: length 26.6
  Top Layer w0.4: v1(20.4,37.43) 20.38,37.42 R5.1 11.36,37.43 D2.1 ; U3.15 v1(28.41,31.87)
  Bottom Layer w0.4: v1(28.41,31.87) 22.85,37.43 v1(20.4,37.43)
PCLK_IO13: length 19.9
  Top Layer w0.3: v1(21.32,26.11) 21.37,26.11 21.42,26.06 25.86,26.06 27.72,24.2 32.01,24.2
  Bottom Layer w0.3: v1(21.32,26.11) 21.21,26 12.94,26
PWDN: length 4.3
  Top Layer w0.3: v1(11.78,21.73) 11.78,22.45 10.14,24.09 R3.1
  Bottom Layer w0.3: v1(11.78,21.73) 12.01,21.5 12.94,21.5
R1_IN: length 14.6
  Top Layer w0.4: 17.63,12.39 20.2,12.39 20.6,11.99 22.79,11.99 24.02,10.76 25.09,10.76 25.91,9.95 25.91,7.19 26.6,6.5 28.13,6.5
R1IN: length 14.9
  Top Layer w0.3: R10.2 15.1,12.39 14.33,13.16 14.33,14.43 12.94,15.83 USB2.8 5.44,15.83 5.2,16.07 5.2,16.63 5.4,16.83 USB2.6
R1OUT: length 8.6
  Top Layer w0.4: R11.1 33.92,9.79 29.35,5.23 28.13,5.23
RXD0: length 19.5
  Top Layer w0.4: R11.2 39.42,9.79 44.62,14.99 U3.36
  Bottom Layer w0.4: v1(39.32,9.84) 39.32,3.82 H1.4
SCL_IO5: length 46.7
  Top Layer w0.3: 44.72,33.59 44.72,24.37 40.34,19.99 v1(35.7,19.99)
  Top Layer w0.4: R6.2 42.74,36.67 44.62,34.79 U3.5
  Bottom Layer w0.3: v1(35.7,19.99) 12.95,19.99 12.94,20
SDA_IO4: length 48
  Top Layer w0.3: v1(34.78,19.02) 40.34,19.02 45.99,24.67 45.99,33.59
  Top Layer w0.4: 44.37,36.68 44.37,36.06 45.89,34.54 U3.4
  Bottom Layer w0.3: v1(34.78,19.02) 34.76,19 12.94,19
T1_OUT: length 14.4
  Top Layer w0.4: 17.63,14.33 19.74,14.33 21.52,12.55 23.15,12.55 24.38,11.32 25.6,11.32 26.52,10.4 26.52,8.31 27.06,7.77 28.13,7.77
T1IN: length 8.3
  Top Layer w0.4: R12.1 34.8,7.75 31.01,3.96 28.13,3.96
T1OUT: length 12.8
  Top Layer w0.3: USB2.5 7.56,17.33 7.91,16.98 7.91,16.39 7.84,16.33 ; USB2.7 7.84,16.33 ; 7.84,16.33 14.09,16.33 16.03,14.38 R9.2
TXD0: length 19.7
  Top Layer w0.4: U3.37 45.89,14.99 38.7,7.8 R12.2 36.4,4.2 H1.3
USB_D+: length 19
  Top Layer w0.3: D1.4 29.73,33.02 32.32,35.61 33.38,35.61 33.59,35.4 33.59,35.1 33.19,34.69 U3.14
USB_D-: length 19.2
  Top Layer w0.3: U3.13 34.46,35.18 33.57,36.06 32.13,36.06 30.91,34.83 17.81,34.83 D1.6
VSY_IO6: length 38.4
  Top Layer w0.3: 43.45,33.59 43.45,30.7 42.02,29.27 40.49,29.27 39.17,27.95 39.17,26.21 v1(34.02,21.06)
  Bottom Layer w0.3: 12.94,21 33.95,21 v1(34.02,21.06)
XCLK_IO15: length 33.3
  Top Layer w0.3: v1(34.55,24.91) 40.91,31.27 40.91,33.59
  Bottom Layer w0.3: 12.94,24 13.87,24 13.9,23.97 32.9,23.97 33.84,24.91 v1(34.55,24.91)
$9N284520: length 4.8
  Top Layer w0.4: C20.1 19.52,2.27 19.55,2.27 21.24,3.96 U4.6
$9N284523: length 5.4
  Top Layer w0.4: v1(19.94,7.15) 19.53,6.73 C16.2 ; v1(20.71,8.99) 20.76,9.04 U4.2
  Bottom Layer w0.4: v1(19.94,7.15) 19.94,8.22 v1(20.71,8.99)
$9N284524: length 4.5
  Top Layer w0.4: U4.4 20.26,6.5 C19.2
$9N284525: length 4.6
  Top Layer w0.4: C19.1 19.31,3.36 21.19,5.23 U4.5
$9N284526: length 3.9
  Top Layer w0.4: C17.2 18.82,10.31 U4.1
$9N284527: length 4.1
  Top Layer w0.4: U4.3 20.35,7.77 19.51,8.61 C17.1
$9N284875: length 2.4
  Top Layer w0.3: D3.1 8.22,8.99 R13.1

## Copper pours and planes (outline as drawn; the poured copper is in the pictures)
GND on Top Layer: -0.61,48 55.95,48 55.95,-0.7 -0.61,-0.7
GND on Bottom Layer: -0.51,48 56.05,48 56.05,-0.7 -0.51,-0.7

Small or netless copper shapes (teardrops, artwork), in the pictures only: 177 on Top Layer, 41 on Bottom Layer

## Text on the board
Top Silkscreen Layer: 20260323 | 5V | GND | T0 | R0 | RST | BOOT | USB Video | RS232
